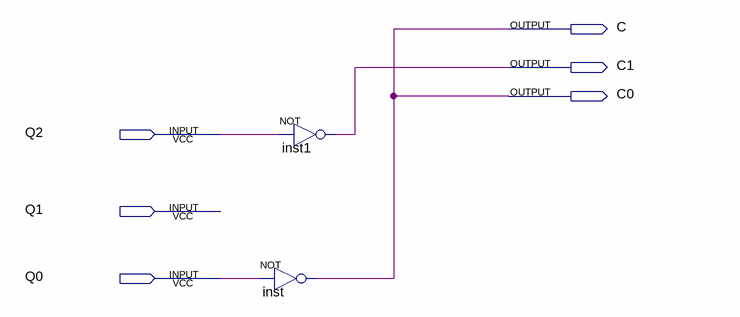
[diagram p0: schematic sheet]
// Quartus schematic C_C2.bdf as structural Verilog: 2 symbols, 6 pins
module C_C2 (
  input  Q2,
  input  Q1,
  input  Q0,
  output C,
  output C1,
  output C0
);

  not inst1 (C1, Q2);
  not inst (C, Q0);

  assign C0 = C;
endmodule
